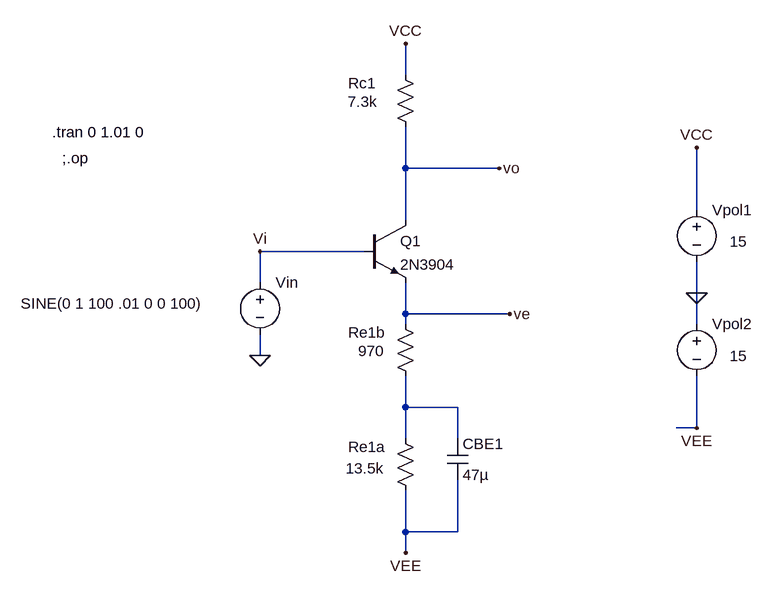
[diagram p0: schematic laboE4.asc]
laboE4.asc, the LTspice schematic file:
Version 4
SHEET 1 3532 2244
WIRE 400 -144 400 -192
WIRE 400 0 400 -64
WIRE 544 0 400 0
WIRE 848 64 848 -32
WIRE 400 80 400 0
WIRE 336 128 176 128
WIRE 176 176 176 128
WIRE 848 192 848 144
WIRE 400 224 400 176
WIRE 560 224 400 224
WIRE 400 240 400 224
WIRE 848 240 848 192
WIRE 176 288 176 256
WIRE 400 368 400 320
WIRE 480 368 400 368
WIRE 848 400 848 320
WIRE 848 400 816 400
WIRE 400 416 400 368
WIRE 480 416 480 368
WIRE 400 560 400 496
WIRE 480 560 480 480
WIRE 480 560 400 560
WIRE 400 592 400 560
FLAG 400 -192 VCC
FLAG 400 592 VEE
FLAG 544 0 vo
FLAG 176 128 Vi
FLAG 176 288 0
FLAG 560 224 ve
FLAG 848 400 VEE
FLAG 848 -32 VCC
FLAG 848 192 0
SYMBOL voltage 176 160 R0
WINDOW 39 0 0 Left 0
WINDOW 3 -368 48 Left 2
SYMATTR Value SINE(0 1 100 .01 0 0 100)
SYMATTR Value2 AC 0 0
SYMATTR InstName Vin
SYMBOL npn 336 80 R0
SYMATTR InstName Q1
SYMATTR Value 2N3904
SYMBOL res 384 -160 R0
WINDOW 0 -72 29 Left 2
WINDOW 3 -73 57 Left 2
SYMATTR InstName Rc1
SYMATTR Value 7.3k
SYMBOL res 384 400 R0
WINDOW 0 -72 29 Left 2
WINDOW 3 -76 62 Left 2
SYMATTR InstName Re1a
SYMATTR Value 13.5k
SYMBOL res 384 224 R0
WINDOW 0 -72 29 Left 2
WINDOW 3 -57 57 Left 2
SYMATTR InstName Re1b
SYMATTR Value 970
SYMBOL cap 464 416 R0
SYMATTR InstName CBE1
SYMATTR Value 47µ
SYMBOL voltage 848 48 R0
WINDOW 39 0 0 Left 0
WINDOW 3 51 65 Left 2
SYMATTR Value 15
SYMATTR Value2 AC 0 0
SYMATTR InstName Vpol1
SYMBOL voltage 848 224 R0
WINDOW 39 0 0 Left 0
WINDOW 3 51 65 Left 2
SYMATTR Value 15
SYMATTR Value2 AC 0 0
SYMATTR InstName Vpol2
TEXT -128 -16 Left 2 !;.op
TEXT -144 -56 Left 2 !.tran 0 1.01 0

The netlist it stands for:
* laboE4.asc
Vin Vi 0 SINE(0 1 100 .01 0 0 100) AC 0 0
Q1 vo Vi ve 0 2N3904
Rc1 VCC vo 7.3k
Re1a N001 VEE 13.5k
Re1b ve N001 970
CBE1 N001 VEE 47µ
Vpol1 VCC 0 15 AC 0 0
Vpol2 0 VEE 15 AC 0 0
.model NPN NPN
.model PNP PNP
.lib standard.bjt
;.op
.tran 0 1.01 0
.backanno
.end